# Altium schematic sheet UNG8077_EVB_7801-9031_A_2-7801.SchDoc
size 416 x 264 mm; SheetNumber: 2; PageTitle: USB LAN7801_1; PageSetup: Record=PageOptions|CenterHorizontal=True|CenterVertical=True|PrintScale=1.02|XCorrection=1.00|YCorrection=1.00|PrintKind=0|BorderSize=5000000|LeftOffset=0|BottomOffset=0|Orientation=2|PaperLength=1000|PaperWidth=1000|Scale=100|PaperSource=7|PrintQuality=-3|MediaType=1|DitherType=10|PrintScaleMode=1|PaperKind=11 x 17|PaperIndex=119; DocumentFullPathAndName: //depot_np_hweng_boards/ung_hweng/UNG_8077_LAN7801-KSZ9031_DemoEVB/A/
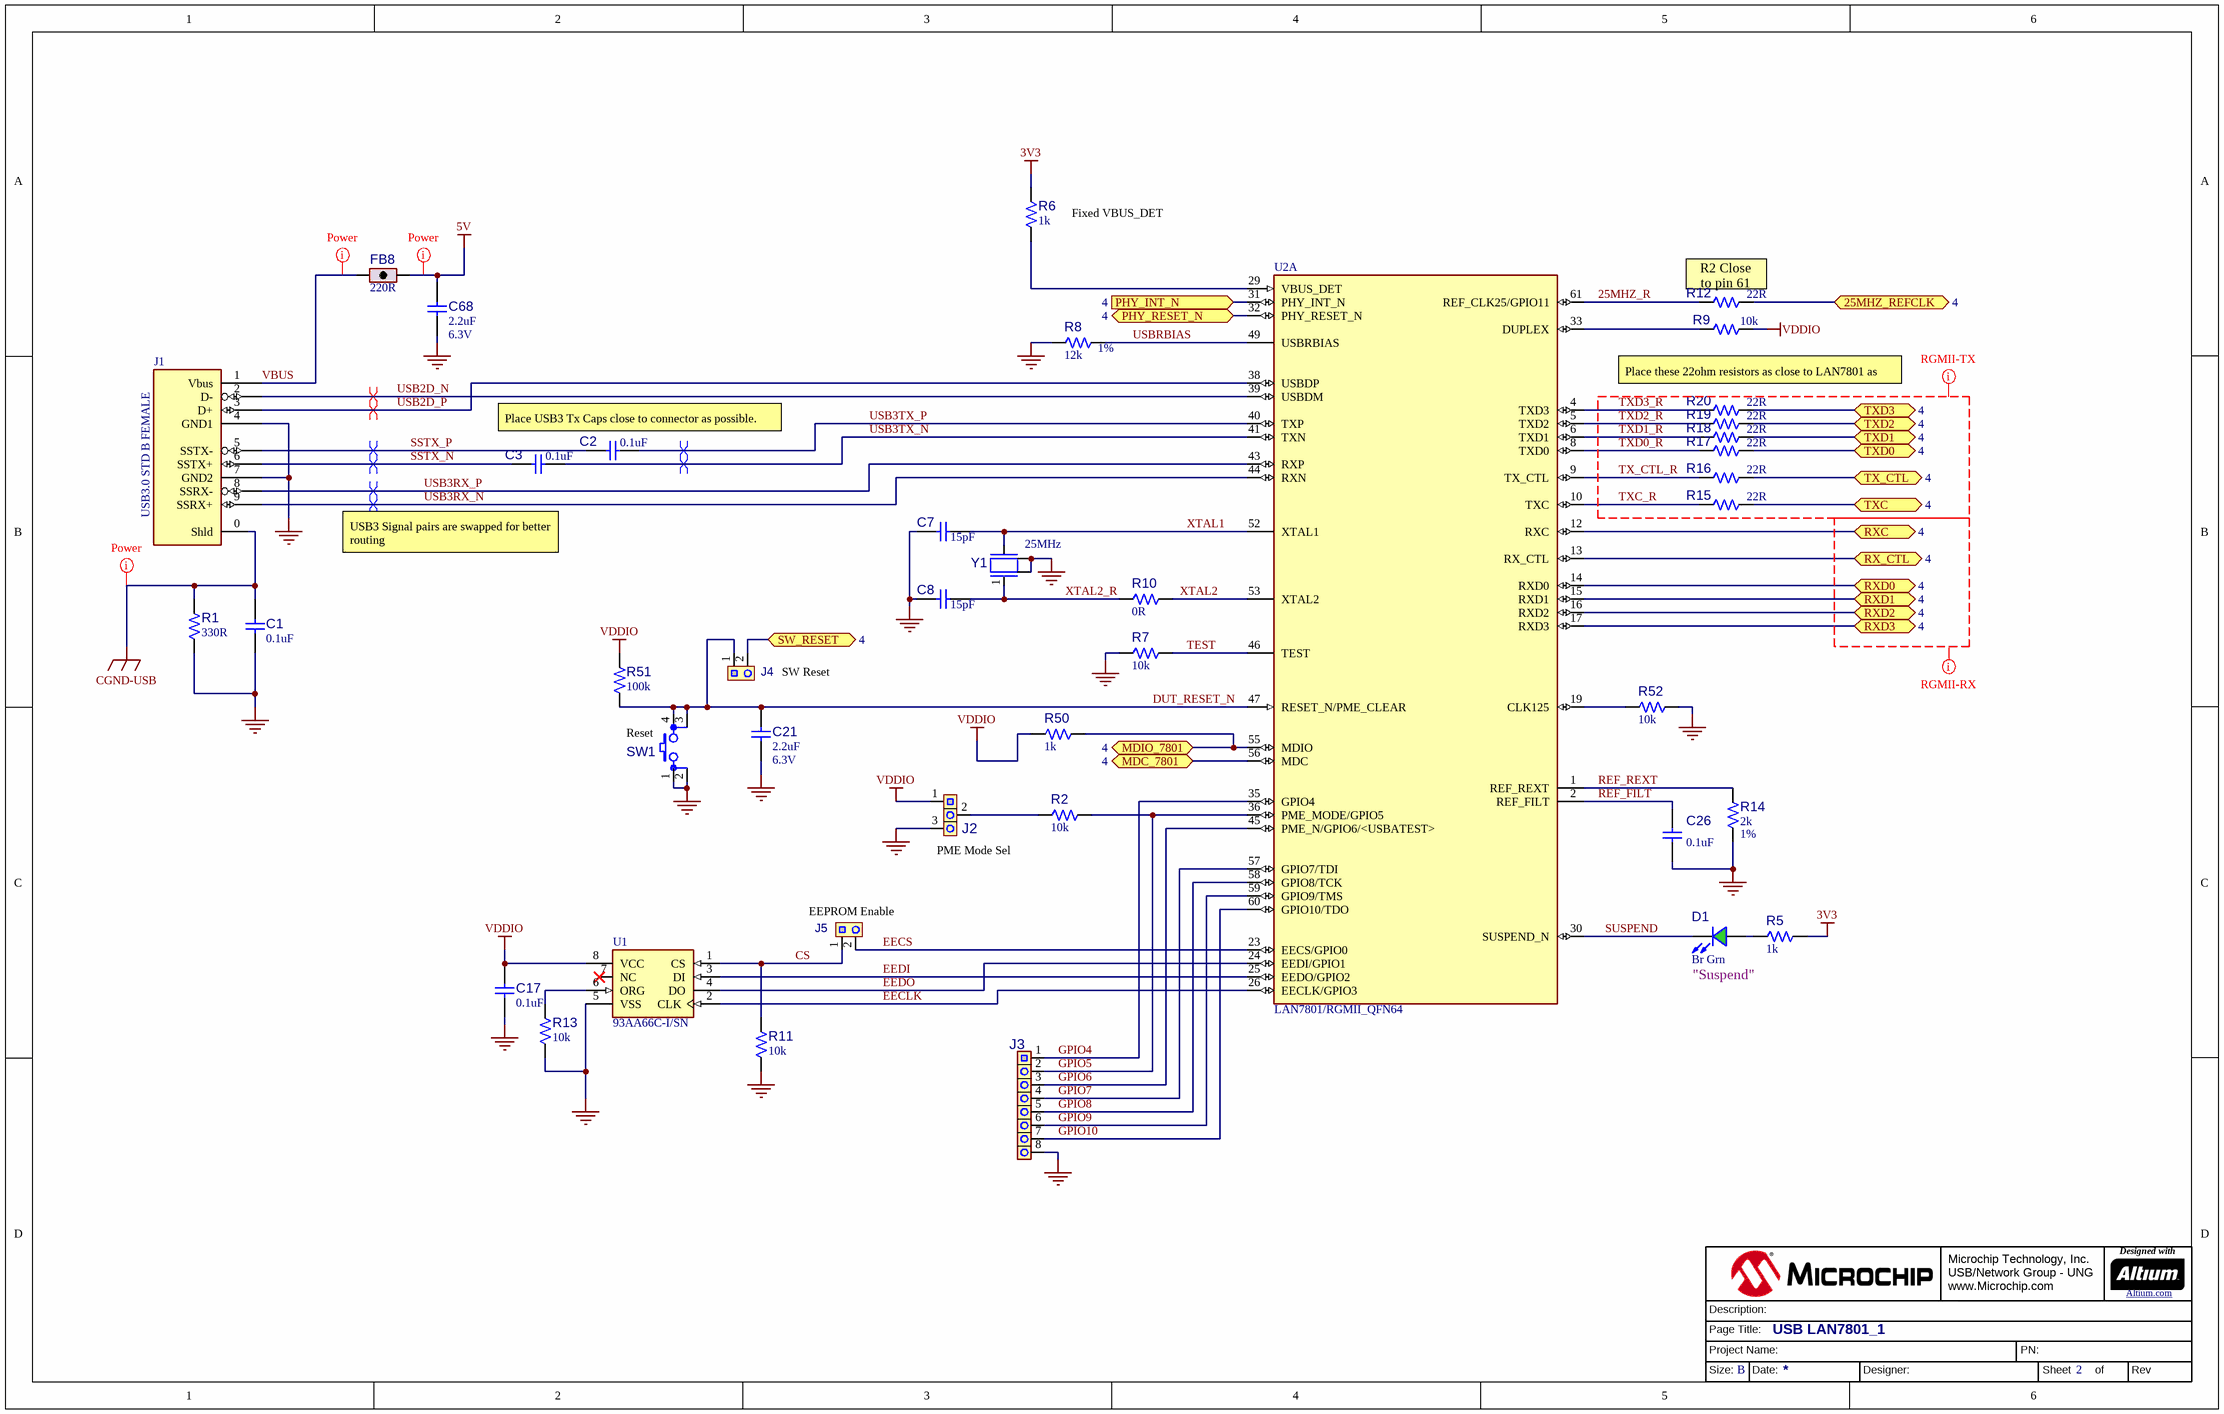
[diagram p0: UNG8077_EVB_7801-9031_A_2-7801.SchDoc]

## Parts
?  (no value)  (graphical)
C1  value 0.1uF  [CAP_C_0402]  (hidden comment: CAP CER 0.1UF 35V)
C2  value 0.1uF  [CAP_C_0402]  (hidden comment: CAP CER 0.1UF 35V)
C3  value 0.1uF  [CAP_C_0402]  (hidden comment: CAP CER 0.1UF 35V)
C7  value 15pF  [CAP_C_0402]  (hidden comment: Capacitor NP)
C8  value 15pF  [CAP_C_0402]  (hidden comment: Capacitor NP)
C17  value 0.1uF  [CAP_C_0402]  (hidden comment: Capacitor NP)
C21  value 2.2uF  Voltage: 6.3V  [CAP_C_0603]  (hidden comment: Capacitor NP)
C26  value 0.1uF  [CAP_C_0402]  (hidden comment: Capacitor NP)
C68  value 2.2uF  Voltage: 6.3V  [CAP_C_0603]  (hidden comment: Capacitor NP)
D1  value Br Grn  [LED_0603_GREEN]  (hidden comment: LED)
FB8  value 220R  [IND_C_0603]  (hidden comment: Ferrite Bead)
J1  value USB3.0 STD B FEMALE  [CON_USB3.0_B_RCPT_TH_RA_WE_692221030100]  (hidden comment: CON USB3.0 B)
J2  Header 3 Pin  [HDR_M_2.54_1x3]  (value not drawn)
J3  Header 1x8  [HDR_M_2.54_1x8]  (value not drawn)
J4  Jumper  [HDR_M_2.54_1x2]  (value not drawn)
J5  Jumper  [HDR_M_2.54_1x2]  (value not drawn)
R1  value 330R  [RES_C_0603]  (hidden comment: Resistor)
R2  value 10k  [RES_C_0603]  (hidden comment: Resistor)
R5  value 1k  [RES_C_0603]  (hidden comment: Resistor)
R6  value 1k  [RES_C_0603]  (hidden comment: Resistor)
R7  value 10k  [RES_C_0603]  (hidden comment: Resistor)
R8  value 12k  Tolerance: 1%  [RES_C_0603]  (hidden comment: Resistor)
R9  value 10k  [RES_C_0603]  (hidden comment: Resistor)
R10  value 0R  [RES_C_0603]  (hidden comment: Resistor)
R11  value 10k  [RES_C_0603]  (hidden comment: Resistor)
R12  value 22R  [RES_C_0402]  (hidden comment: Resistor)
R13  value 10k  [RES_C_0603]  (hidden comment: Resistor)
R14  value 2k  Tolerance: 1%  [RES_C_0603]  (hidden comment: Resistor)
R15  value 22R  [RES_C_0402]  (hidden comment: Resistor)
R16  value 22R  [RES_C_0402]  (hidden comment: Resistor)
R17  value 22R  [RES_C_0402]  (hidden comment: Resistor)
R18  value 22R  [RES_C_0402]  (hidden comment: Resistor)
R19  value 22R  [RES_C_0402]  (hidden comment: Resistor)
R20  value 22R  [RES_C_0402]  (hidden comment: Resistor)
R50  value 1k  [RES_C_0603]  (hidden comment: Resistor)
R51  value 100k  [RES_C_0603]  (hidden comment: Resistor)
R52  value 10k  [RES_C_0603]  (hidden comment: Resistor)
SW1  Switch 4 Pin  [SW_TACT_SMD_CK_PTS810SJM]  (value not drawn)
U1  93AA66C-I/SN  [SOIC8-UNIV]
U2  LAN7801/RGMII_QFN64  [QFN-64_9x9_EP6SQ]  (part A of 2)
Y1  Frequency: 25MHz  [XTAL_4PIN_3M2X2M5]  (hidden comment: XTAL 25MHz 4 pins 3225)

## Ports
25MHZ_REFCLK (bidir, see 4), MDC_7801 (bidir, see 4), MDIO_7801 (bidir, see 4), PHY_INT_N (in, see 4), PHY_RESET_N (bidir, see 4), RX_CTL (bidir, see 4), RXC (bidir, see 4), RXD0 (bidir, see 4), RXD1 (bidir, see 4), RXD2 (bidir, see 4), RXD3 (bidir, see 4), SW_RESET (bidir, see 4), TX_CTL (bidir, see 4), TXC (bidir, see 4), TXD0 (bidir, see 4), TXD1 (bidir, see 4), TXD2 (bidir, see 4), TXD3 (bidir, see 4)

## Nets
3V3: R5.1 R6.1
5V: C68.2 FB8.2
CGND-USB: C1.2 J1.0(Shld) R1.2
GND: C1.1 C7.1 C8.1 C17.1 C21.1 C26.1 C68.1 J1.4(GND1) J1.7(GND2) J2.3(P3) J3.8(P8) R1.1 R7.1 R8.2 R11.1 R13.2 R14.1 R52.2 SW1.1 SW1.2 U1.5(VSS) Y1.2(GND) Y1.4(GND)
VDDIO: C17.2 J2.1(P1) R9.2 R50.2 R51.2 U1.8(VCC)
25MHZ_R: R12.1 U2.61(REF_CLK25/GPIO11)
25MHZ_REFCLK: R12.2 ; port 25MHZ_REFCLK
CS: J5.1(P1) R11.2 U1.1(CS)
DUT_RESET_N: C21.2 J4.1(P1) R51.1 SW1.3 SW1.4 U2.47(RESET_N/PME_CLEAR)
EECLK: U1.2(CLK) U2.26(EECLK/GPIO3)
EECS: J5.2(P2) U2.23(EECS/GPIO0)
EEDI: U1.3(DI) U2.25(EEDO/GPIO2)
EEDO: U1.4(DO) U2.24(EEDI/GPIO1)
GPIO4: J3.1(P1) U2.35(GPIO4)
GPIO5: J3.2(P2) R2.2 U2.36(PME_MODE/GPIO5)
GPIO6: J3.3(P3) U2.45(PME_N/GPIO6/<USBATEST>)
GPIO7: J3.4(P4) U2.57(GPIO7/TDI)
GPIO8: J3.5(P5) U2.58(GPIO8/TCK)
GPIO9: J3.6(P6) U2.59(GPIO9/TMS)
GPIO10: J3.7(P7) U2.60(GPIO10/TDO)
MDC_7801: U2.56(MDC) ; port MDC_7801
MDIO_7801: R50.1 U2.55(MDIO) ; port MDIO_7801
PHY_INT_N: U2.31(PHY_INT_N) ; port PHY_INT_N
PHY_RESET_N: U2.32(PHY_RESET_N) ; port PHY_RESET_N
REF_FILT: C26.2 U2.2(REF_FILT)
REF_REXT: R14.2 U2.1(REF_REXT)
RX_CTL: U2.13(RX_CTL) ; port RX_CTL
RXC: U2.12(RXC) ; port RXC
RXD0: U2.14(RXD0) ; port RXD0
RXD1: U2.15(RXD1) ; port RXD1
RXD2: U2.16(RXD2) ; port RXD2
RXD3: U2.17(RXD3) ; port RXD3
SSTX_N: C3.1 J1.6(SSTX+)
SSTX_P: C2.1 J1.5(SSTX-)
SUSPEND: D1.2(K) U2.30(SUSPEND_N)
SW_RESET: J4.2(P2) ; port SW_RESET
TEST: R7.2 U2.46(TEST)
TX_CTL: R16.2 ; port TX_CTL
TX_CTL_R: R16.1 U2.9(TX_CTL)
TXC: R15.2 ; port TXC
TXC_R: R15.1 U2.10(TXC)
TXD0: R17.2 ; port TXD0
TXD0_R: R17.1 U2.8(TXD0)
TXD1: R18.2 ; port TXD1
TXD1_R: R18.1 U2.6(TXD1)
TXD2: R19.2 ; port TXD2
TXD2_R: R19.1 U2.5(TXD2)
TXD3: R20.2 ; port TXD3
TXD3_R: R20.1 U2.4(TXD3)
USB2D_N: J1.2(D-) U2.39(USBDM)
USB2D_P: J1.3(D+) U2.38(USBDP)
USB3RX_N: J1.9(SSRX+) U2.44(RXN)
USB3RX_P: J1.8(SSRX-) U2.43(RXP)
USB3TX_N: C3.2 U2.41(TXN)
USB3TX_P: C2.2 U2.40(TXP)
USBRBIAS: R8.1 U2.49(USBRBIAS)
VBUS: FB8.1 J1.1(Vbus)
XTAL1: C7.2 U2.52(XTAL1) Y1.3(Osc2)
XTAL2: R10.2 U2.53(XTAL2)
XTAL2_R: C8.2 R10.1 Y1.1(Osc1)
NetD1_1: D1.1(A) R5.2
NetJ2_2: J2.2(P2) R2.1
NetR6_2: R6.2 U2.29(VBUS_DET)
NetR9_1: R9.1 U2.33(DUPLEX)
NetR13_1: R13.1 U1.6(ORG)
NetR52_1: R52.1 U2.19(CLK125)

Not connected (* = marked no-connect by the designer): U1 7(NC)*

## Layout directives
net class Power (VBUS): 5V, CGND-USB, VBUS
differential pair; net class USB2.: USB2D_N, USB2D_P
differential pair; net class USB3.: SSTX_N, SSTX_P, USB3RX_N, USB3RX_P, USB3TX_N, USB3TX_P
net class RGMII-RX: (no net found under the mark)
net class RGMII-TX: TX_CTL_R, TXC_R, TXD0_R, TXD1_R, TXD2_R, TXD3_R

## Notes on the sheet
- (near R6) Fixed VBUS_DET
- (near R12) R2 Close
  to pin 61
- Place these 22ohm resistors as close to LAN7801 as possible.
- Place USB3 Tx Caps close to connector as possible.
- (near C3) USB3 Signal pairs are swapped for better routing
- SW Reset
- (near SW1) Reset
- (near J2) PME Mode Sel
- (near J5) EEPROM Enable
- "Suspend"
- Microchip Technology, Inc.
  USB/Network Group - UNG
  www.Microchip.com
- Designed with
- Altium.com <http://go.altium.com/MicrochipLandingPage_Evaluation.html>
- Page Title:
- Project Name:
- Description:
- PN:
- Size:
- B
- Date:
- Designer:
- Sheet
- of
- Rev

## Library data of the parts
? = Title Block B_UNG1_Altium
C1-C3 = CAP1463: Capacitor; Manufacturer 1: TDK Corporation; Manufacturer Part Number 1: C1005X7R1H104K050BB; Tolerance: 10%; Description_: CAP CER 0.1uF 50V 10% X7R SMD 0402; Dev Tools Status: Design; Temperature Coeffcient: X7R; Type: Ceramic; Owner: Jamus Griego; Populated: YES; Revision: A; ComponentLink1URL: https://chn-vm-apps.microchip.com/mchprepo/parts/Datasheets/TDKMLCCCapRange.pdf; ComponentLink1Description: Datasheets; Operating Temperature: -55C to +125C; Category: Capacitor; Supplier 1: Digi-Key; Supplier Part Number 1: 445-5932-1-ND; MCHP-ID: CAP1463; Status: MCL Design; Quantity Override: 1
C7 C8 = CAP0608: Capacitor; Manufacturer 1: Murata; Manufacturer Part Number 1: GRM1555C1H150JA01D; Description_: CAP CER 15pF 50V 5% NP0 SMD 0402; Dev Tools Status: Production; Tolerance: 5%; Temperature Coeffcient: NP0; Type: Ceramic; Populated: Yes; MCHP-ID: CAP0608; Revision: 1; Status: MCL Design; ComponentLink1URL: https://chn-vm-apps.microchip.com/mchprepo/parts/Datasheets/L0005E.pdf; ComponentLink1Description: Datasheet; Operating Temperature: -55C to +125C; Category: Capacitor; Manufacturer 2: Murata; Manufacturer Part Number 2: GRM1555C1H150JZ01D; Supplier 1: Digi-Key; Supplier Part Number 1: 490-5888-2-ND; Supplier 2: Digi-Key; Supplier Part Number 2: 490-1280-1-ND; Quantity Override: 1
C17 = CAP1463: Capacitor; Manufacturer 1: TDK Corporation; Manufacturer Part Number 1: C1005X7R1H104K050BB; Description_: CAP CER 0.1uF 50V 10% X7R SMD 0402; Tolerance: 10%; Temperature Coeffcient: X7R; Type: Ceramic; Populated: YES; Dev Tools Status: Design; Owner: Jamus Griego; MCHP-ID: CAP1463; Revision: A; Status: MCL Design; ComponentLink1URL: https://chn-vm-apps.microchip.com/mchprepo/parts/Datasheets/TDKMLCCCapRange.pdf; ComponentLink1Description: Datasheets; Operating Temperature: -55C to +125C; Category: Capacitor; Supplier 1: Digi-Key; Supplier Part Number 1: 445-5932-1-ND; Quantity Override: 1
C21 C68 = CAP1126: Capacitor; Manufacturer 1: TDK; Manufacturer Part Number 1: C1608X7R0J225K; Description_: CAP CER 2.2uF 6.3V 10% X7R SMD 0603; Dev Tools Status: Production; Tolerance: 10%; Temperature Coeffcient: X7R; Type: Ceramic; Owner: Adrian T (M91397); Populated: Yes; MCHP-ID: CAP1126; Package: 0603; Revision: 0; Symbol: Capacitor NP; Status: MCL Design; ComponentLink1URL: https://chn-vm-apps.microchip.com/mchprepo/parts/Datasheets/general_B11.pdf; ComponentLink1Description: Datasheet; Operating Temperature: -55C to +125C; Category: Capacitor; Supplier 1: Digi-Key; Supplier Part Number 1: 445-5960-1-ND; Quantity Override: 1
C26 = CAP1463: Capacitor; Manufacturer 1: TDK Corporation; Manufacturer Part Number 1: C1005X7R1H104K050BB; Description_: CAP CER 0.1uF 50V 10% X7R SMD 0402; Dev Tools Status: Design; Tolerance: 10%; Temperature Coeffcient: X7R; Type: Ceramic; Owner: Jamus Griego; Populated: YES; MCHP-ID: CAP1463; Revision: A; Status: MCL Design; ComponentLink1URL: https://chn-vm-apps.microchip.com/mchprepo/parts/Datasheets/TDKMLCCCapRange.pdf; ComponentLink1Description: Datasheets; Operating Temperature: -55C to +125C; Category: Capacitor; Supplier 1: Digi-Key; Supplier Part Number 1: 445-5932-1-ND; Quantity Override: 1
D1 = LED, Bright Green, 0603: Manufacturer 1: Lite-On; Manufacturer Part Number 1: LTST-C191KGKT; Type: LED Single; Forward Current: 20mA; MCD: 35mcd; Owner: Jennifer Hancock; DNP: No; Viewing Angle: 130°; Revision: -; Description_: LED, Bright Green, 0603; Package: 0603 (1608 Metric); ComponentLink1URL: http://optoelectronics.liteon.com/upload/download/DS22-2000-228/S_110_LTST-C191KGKT.pdf; ComponentLink1Description: Datasheet; Category: Diode; Supplier 1: Digi-Key; Supplier Part Number 1: 160-1446-6-ND; Mounting Type: Surface Mount
FB8 = IND1313: Manufacturer 1: Murata Electronics North America; Manufacturer Part Number 1: BLM18EG221SN1D; Description_: FERRITE 220R @ 100MHz 2A SMD 0603; Dev Tools Status: Design; Owner: Razvan Cristescu; Populated: YES; MCHP-ID: IND1313; Revision: A; Symbol: Ferrite Bead; Status: MCL Design; ComponentLink1Description: Datasheet; Package: 0603; Type: Ferrite Bead; Category: Inductor; Supplier 1: Digi-Key; Supplier Part Number 1: 490-3992-6-ND; Quantity Override: 1
J1 = CON1543: Manufacturer 1: Wurth Electronics Inc; Manufacturer Part Number 1: 692221030100; Description_: CON USB3.0 STD B Female TH R/A; Dev Tools Status: Design; Owner: Sam Charles; Populated: YES; Revision: A; MCHP-ID: CON1543; Symbol: CON USB3.0 B; Status: MCL Design; ComponentLink1URL: https://chn-vm-apps.microchip.com/mchprepo/parts/Datasheets/692221030100.pdf; ComponentLink1Description: datasheet; Type: USB; Category: Connector; Supplier 1: Digi-Key; Supplier Part Number 1: 732-3158-ND; Quantity Override: 1
J2 = HDR1X3: Header 3-Pin; Manufacturer: Samtec; Manufacturer Part Number: TSW-103-07-G-S; Description_: HDR 3POS .100" SGL GOLD; DNP: No; Category: Header; Mounting Type: Through Hole; Supplier 1: Digi-Key; Supplier Part Number 1: SAM1029-03-ND; Type: Male
J3 = Header 1x8: CONN HEADER 8POS .100" SGL GOLD; Manufacturer 1: Samtec; Manufacturer Part Number 1: TSW-108-07-G-S; Part Checked: Jennifer Hancock; Populated: Yes; Description_: CON HDR-2.54 MALE 1x8 GOLD 5.84MH TH VERT; Value: HDR-2.54 Male 1x8; Supplier 1: Digi-Key; Supplier Part Number 1: SAM1029-08-ND; Manufacturer Part Number 2: 68000-236HLF; Manufacturer 2: FCI; Document Link: //depot_np_hweng_boards/altium_libraries/datasheets/Samtec/TSW_TH.pdf; Owner: *; Tolerance: *; Rating: *; Part 3D Model Checked: Jennifer Hancock; Part Golden: Jennifer Hancock; Part Footprint Checked: *; Revision Date: 08/14/2015; Package: Through Hole
J4 J5 = HDR1X2: Header 2-Pin; Manufacturer: Samtec; Manufacturer Part Number: TSW-102-07-G-S; Description_: HDR 2POS .100" SGL GOLD; DNP: No; Category: Header; Mounting Type: Through Hole; Supplier 1: Digi-Key; Supplier Part Number 1: SAM1029-02-ND; Type: Male
R1 = RES1346: Manufacturer 1: Panasonic Electronic Components; Manufacturer Part Number 1: ERA-V33J331V; Tolerance: 5%; Description_: RES MF 330R 5% 1/16W SMD 0603; Dev Tools Status: Production; Temperature Coeffcient: 3300ppm/C; Circuit Type: Isolated; Power: 1/16W; Owner: Jairuz Agang-ang; Populated: YES; MCHP-ID: RES1346; Package: 0603; Revision: A; Symbol: Resistor; Status: MCL Design; ComponentLink1URL: https://chn-vm-apps.microchip.com/mchprepo/parts/Datasheets/AOF0000CE1.pdf; ComponentLink1Description: Datasheet; Operating Temperature: -40C to +125C; Category: Resistor; Type: RES SMD; Composition: MF; Supplier 1: Digi-Key; Supplier Part Number 1: P330CHTR-ND; Quantity Override: 1
R2 R7 R11 R13 R52 = RES0191: Manufacturer 1: Panasonic; Manufacturer Part Number 1: ERJ-3GEYJ103V; Description_: RES TKF 10k 5% 1/10W SMD 0603; Voltage: 75V; Temperature Coeffcient: 200ppm/C; Power: 1/10W; Populated: Yes; MCHP-ID: RES0191; Revision: 2; Status: Production; ComponentLink1URL: https://chn-vm-apps.microchip.com/mchprepo/parts/Datasheets/AOA0000CE1.pdf; ComponentLink1Description: Datasheet; Operating Temperature: -55C to +155C; Category: Resistor; Type: RES SMD; Composition: TKF; Manufacturer 2: NIC Components; Manufacturer Part Number 2: NRC06J103TRF; Manufacturer 3: Yageo; Manufacturer Part Number 3: RC0603JR-0710KL; Supplier 1: Digi-Key; Supplier Part Number 1: P10KGCT-ND; Supplier 2: Digi-Key; Supplier Part Number 2: P10KGTR-ND; Supplier 3: NIC Components; Supplier Part Number 3: NRC06J103TRF; Supplier 4: Digi-Key; Supplier Part Number 4: 311-10KGRTR-ND; Quantity Override: 1
R5 R6 R50 = RSMT0138: Manufacturer 1: Panasonic; Manufacturer Part Number 1: ERJ-3EKF1001V; Tolerance: 1%; Description_: RES TKF 1k 1% 1/10W SMD 0603; Dev Tools Status: Production; Voltage: 75V; Temperature Coeffcient: 100ppm/C; Power: 1/10W; Populated: Yes; MCHP-ID: RSMT0138; Package: 0603; Revision: 2; Symbol: Resistor; Status: MCL Design; ComponentLink1URL: https://chn-vm-apps.microchip.com/mchprepo/parts/Datasheets/AOA0000CE2.pdf; ComponentLink1Description: Datasheet; Operating Temperature: -55C to +155C; Category: Resistor; Type: RES SMD; Composition: TKF; Manufacturer 2: Yageo; Manufacturer Part Number 2: RC0603FR-071KL; Manufacturer 3: ROHM; Manufacturer Part Number 3: MCR03EZPFX1001; Manufacturer 4: Stackpole Electronics Inc; Manufacturer Part Number 4: RMCF0603FT1K00; Manufacturer 5: Stackpole Electronics Inc; Manufacturer Part Number 5: RMCF 1/16 1K 1% R; Manufacturer 6: Vishay; Manufacturer Part Number 6: CRCW06031K00FKEA; Manufacturer 7: Stackpole Electronics Inc; Manufacturer Part Number 7: RMCF1/161.0K1%TR; Manufacturer 8: TE Connectivity; Manufacturer Part Number 8: 1622866-1; Supplier 1: Digi-Key; Supplier Part Number 1: P1.00KHCT-ND; Supplier 2: Digi-Key; Supplier Part Number 2: P1.00KHTR-ND; Supplier 3: Digi-Key; Supplier Part Number 3: 311-1.00KHRCT-ND; Supplier 4: Digi-Key; Supplier Part Number 4: RHM1.00KHCT-ND; Supplier 5: Digi-Key; Supplier Part Number 5: RMCF1/161KFRTR-ND; Supplier 6: Digi-Key; Supplier Part Number 6: RMCF0603FT1K00TR-ND; Supplier 7: Newark; Supplier Part Number 7: 52K8015; Supplier 8: Stackpole Electronics Inc; Supplier Part Number 8: RMCF1/161.0K1%TR; Supplier 9: Digi-Key; Supplier Part Number 9: A106049CT-ND; Quantity Override: 1
R8 = RES1120: Manufacturer 1: Yageo; Manufacturer Part Number 1: RC0603FR-0712KL; Description_: RES TKF 12k 1% 1/10W SMD 0603; Voltage: 50V; Temperature Coeffcient: 100ppm/C; Power: 1/10W; Owner: Mihai T (M91442); Populated: Yes; MCHP-ID: RES1120; Revision: 0; Status: Production; ComponentLink1URL: https://chn-vm-apps.microchip.com/mchprepo/parts/Datasheets/PYu-RC0603_51_RoHS_L_4.pdf; ComponentLink1Description: Datasheet; Operating Temperature: -55C to +155C; Category: Resistor; Type: RES SMD; Composition: TKF; Supplier 1: Digi-Key; Supplier Part Number 1: 311-12.0KHRCT-ND; Supplier 2: Farnell; Supplier Part Number 2: 9238611RL; Quantity Override: 1
R9 = RES0191: Manufacturer 1: Panasonic; Manufacturer Part Number 1: ERJ-3GEYJ103V; Tolerance: 5%; Description_: RES TKF 10k 5% 1/10W SMD 0603; Voltage: 75V; Temperature Coeffcient: 200ppm/C; Power: 1/10W; Populated: Yes; MCHP-ID: RES0191; Revision: 2; Status: Production; ComponentLink1URL: https://chn-vm-apps.microchip.com/mchprepo/parts/Datasheets/AOA0000CE1.pdf; ComponentLink1Description: Datasheet; Operating Temperature: -55C to +155C; Category: Resistor; Type: RES SMD; Composition: TKF; Manufacturer 2: NIC Components; Manufacturer Part Number 2: NRC06J103TRF; Manufacturer 3: Yageo; Manufacturer Part Number 3: RC0603JR-0710KL; Supplier 1: Digi-Key; Supplier Part Number 1: P10KGCT-ND; Supplier 2: Digi-Key; Supplier Part Number 2: P10KGTR-ND; Supplier 3: NIC Components; Supplier Part Number 3: NRC06J103TRF; Supplier 4: Digi-Key; Supplier Part Number 4: 311-10KGRTR-ND; Quantity Override: 1
R10 = RSMT0001: Manufacturer 1: NIC Components; Manufacturer Part Number 1: NRC06Z0TRF; Description_: RES TKF 0R 1/10W SMD 0603; Power: 1/10W; Populated: Yes; MCHP-ID: RSMT0001; Revision: 2; Status: Production; ComponentLink1URL: https://chn-vm-apps.microchip.com/mchprepo/parts/Datasheets/nrc.pdf; ComponentLink1Description: Datasheet; Operating Temperature: -55C to +155C; Category: Resistor; Type: RES SMD; Composition: TKF; Manufacturer 2: Panasonic; Manufacturer Part Number 2: ERJ-3GSY0R00V; Manufacturer 3: Panasonic; Manufacturer Part Number 3: ERJ-3GEY0R00V; Manufacturer 4: Stackpole Electronics Inc; Manufacturer Part Number 4: RMCF0603ZT0R00; Manufacturer 5: Vishay; Manufacturer Part Number 5: CRCW06030000Z0EA; Manufacturer 6: Stackpole Electronics Inc; Manufacturer Part Number 6: RMCF 1/16 0 R; Manufacturer 7: Yageo; Manufacturer Part Number 7: RC0603JR-070RL; Manufacturer 8: KOA Speer; Manufacturer Part Number 8: RK73Z1JTTP; Manufacturer 9: ROHM; Manufacturer Part Number 9: MCR03EZPJ000; Supplier 1: NIC Components; Supplier Part Number 1: NRC06Z0TRF; Supplier 2: Digi-Key; Supplier Part Number 2: P0.0GTR-ND; Supplier 3: Digi-Key; Supplier Part Number 3: RMCF0603ZT0R00TR-ND; Supplier 4: Digi-Key; Supplier Part Number 4: RMCF0603ZT0R00CT-ND; Supplier 5: Digi-Key; Supplier Part Number 5: 541-0.0GCT-ND; Supplier 6: Digi-Key; Supplier Part Number 6: RMCF1/160RTR-ND; Supplier 7: Digi-Key; Supplier Part Number 7: 311-0.0GRCT-ND; Supplier 8: KOA Speer; Supplier Part Number 8: RK73Z1JTTP; Supplier 9: Digi-Key; Supplier Part Number 9: RHM0.0GCT-ND; Quantity Override: 1
R12 R15-R20 = RES1474: Manufacturer 1: Panasonic Electronic Components; Manufacturer Part Number 1: ERJ-2RKF22R0X; Tolerance: 1%; Description_: RES TKF 22R 1% 1/20W SMD 0402; Dev Tools Status: Design; Temperature Coeffcient: 100ppm/C; Circuit Type: Isolated; Power: 1/10W; Owner: Mike Ragsdale; Populated: YES; MCHP-ID: RES1474; Package: 0402; Revision: 1; Symbol: Resistor; Status: MCL Design; Operating Temperature: -55C to +155C; Category: Resistor; Type: RES SMD; Composition: TKF; Supplier 1: Digi-Key; Supplier Part Number 1: P22.0LCT-ND; Quantity Override: 1
R14 = RSMT0382: Manufacturer 1: Panasonic; Manufacturer Part Number 1: ERJ-3EKF2001V; Description_: RES TKF 2k 1% 1/10W SMD 0603; Voltage: 75V; Temperature Coeffcient: 100ppm/C; Power: 1/10W; Populated: Yes; MCHP-ID: RSMT0382; Revision: 1; Status: Production; ComponentLink1URL: https://chn-vm-apps.microchip.com/mchprepo/parts/Datasheets/AOA0000CE2.pdf; ComponentLink1Description: Datasheet; Operating Temperature: -55C to +155C; Category: Resistor; Type: RES SMD; Composition: TKF; Supplier 1: Digi-Key; Supplier Part Number 1: P2.00KHTR-ND; Supplier 2: Digi-Key; Supplier Part Number 2: P2.00KHCT-ND; Quantity Override: 1
R51 = RSMT0215: Manufacturer 1: Panasonic; Manufacturer Part Number 1: ERJ-3EKF1003V; Description_: RES TKF 100k 1% 1/10W SMD 0603; Voltage: 75V; Temperature Coeffcient: 100ppm/C; Power: 1/10W; Populated: Yes; MCHP-ID: RSMT0215; Revision: 1; Status: Production; ComponentLink1URL: https://chn-vm-apps.microchip.com/mchprepo/parts/Datasheets/AOA0000CE2.pdf; ComponentLink1Description: Datasheet; Operating Temperature: -55C to +155C; Category: Resistor; Type: RES SMD; Composition: TKF; Manufacturer 2: Stackpole Electronics Inc; Manufacturer Part Number 2: RMCF0603FT100K; Supplier 1: Digi-Key; Supplier Part Number 1: P100KHTR-ND; Supplier 2: Digi-Key; Supplier Part Number 2: P100KHCT-ND; Supplier 3: Digi-Key; Supplier Part Number 3: RMCF1/16100KFRTR-ND; Supplier 4: Digi-Key; Supplier Part Number 4: RMCF0603FT100KCT-ND; Quantity Override: 1
SW1 = SWITCH1073: Switch; Manufacturer 1: C&K Components; Manufacturer Part Number 1: PTS810 SJM 250 SMTR LFS; Value: TACT SPST-NO; Description_: SWITCH TACT SPST-NO 16V 0.05A PTS810 SMD; Dev Tools Status: Design; Owner: Razvan Cristescu; Voltage: 16V; Current: 0.05A; Populated: YES; MCHP-ID: SWITCH1073; Revision: A; Symbol: Switch 4 Pin; Status: MCL Design; ComponentLink1URL: https://chn-vm-apps.microchip.com/mchprepo/parts/Datasheets/pts810.pdf; ComponentLink1Description: Datasheet; Operating Temperature: -40C to +85C; Category: Switch; Type: Pushbutton; Supplier 1: Digi-Key; Supplier Part Number 1: CKN10502CT-ND; Quantity Override: 1
U1 = 93AA66C-I/SN: 4K, 512x8 or 256x16-bit, 1.8V Microwire Serial EEPROM, 8-Pin SOIC 150mil, Industrial Temperature; Manufacturer 1: Microchip Technology; Part Checked: Manuel Manley; Populated: Yes; Description_: IC EEPROM 4KBIT 3MHZ 8SOIC; Published: 29-Jan-2009; DatasheetVersion: revD, May-2008; PackageVersion: revBB, Aug-2009; PackageReference: SOIC-SN8; Publisher: Altium Limited; PackageDescription: 8-Lead Plastic Small Outline (SN) - Narrow, 3.90mm Body [SOIC]; Supplier 1: Digi-Key; Supplier Part Number 1: 93AA66C-I/SN-ND; Supplier 2: Farnell; Supplier Part Number 2: 1331441; Code_JEDEC: MS-012; Code_IPC: SOIC127P600-8; ComponentLink1Description: Datasheet; ComponentLink1URL: http://ww1.microchip.com/downloads/en/DeviceDoc/21795D.pdf; ComponentLink2Description: Packaging Specification; ComponentLink2URL: http://www.microchip.com/stellent/groups/techpub_sg/documents/packagingspec/en012702.pdf; ComponentLink3Description: Microchip.com Home; ComponentLink3URL: http://www.microchip.com/; Document: *; Document URL: *; Manufacturer Part Number 1: 93AA66C-I/SN; Manufacturer 2: *; Manufacturer Part Number 2: *; Owner: *; Revision Date: *; Part 3D Model Checked: *; Part Footprint Checked: *; Part Golden: *; Package: *; Tolerance: *; Value: *; Rating: *
U2 = LAN7801/RGMII_QFN64: Edinburgh LAN7801/RGMII pinout, QFN64; Manufacturer Part Number: Edinburgh_QFN64; Populated: Yes; Owner: Jennifer Hancock; Supplier 1: Microchip; Description_: Edinburgh LAN7801/RGMII pinout, QFN64; Part Checked: *; Part Footprint Checked: *; Part 3D Model Checked: *; Part Golden: *; Supplier Part Number 1: LAN7801/RGMII_QFN64
Y1 = XTAL 25MHz 4 pins 3225: Crystal 25MHz 4 pins 3225; Manufacturer 1: Abracon; Manufacturer Part Number 1: ABM8G-25.000MHZ-B4Y-T; Frequency Stability: ±30ppm; Load Capacitance: 10pF; Operating Mode: Fundamental; Populated: Yes; Description_: Crystal 25MHz 10pF SMD 4Pin DFN LCC; Revision: A; RoHS: RoHS Compliant; Category: Crystals and Oscillators; Packaging: Cut Tape (CT); Type: 25MHz Crystal; Frequency Tolerance: ±30ppm; Operating Temperature: -20°C ~ 70°C; Package / Case: 4-SMD, No Lead (DFN, LCC); Size / Dimension: 3.2 mm x 2.5mm; ComponentLink1URL: http://nyusperforce.smsc.com//depot_np_hweng_boards/altium_libraries/datasheets/Abracon/ABM8G-10572.pdf; ComponentLink1Description: Datasheet; Supplier 1: Mouser; Supplier Part Number 1: 815-ABM8G-25-B4Y-T